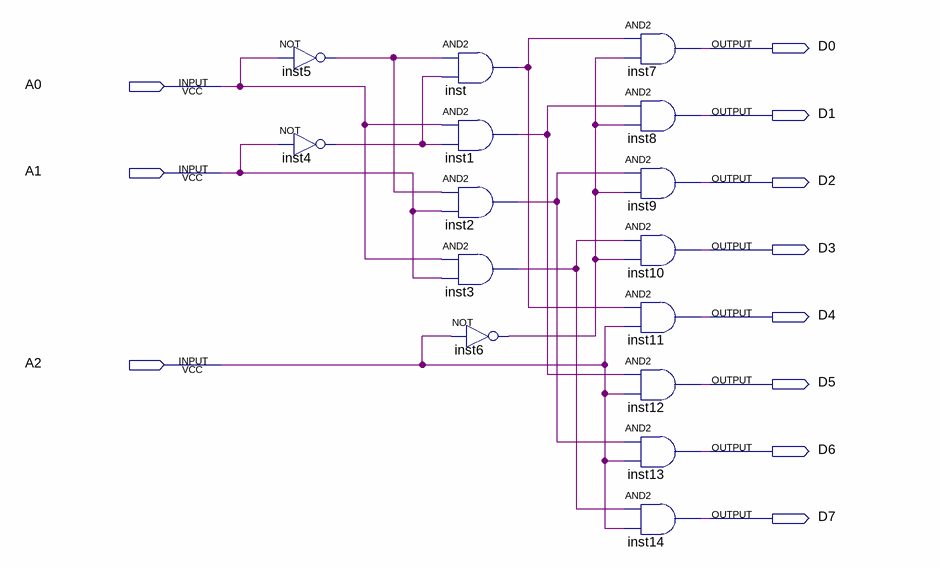
[diagram p0: schematic sheet]
// Quartus schematic decoder3_8.bdf as structural Verilog: 15 symbols, 11 pins
module decoder3_8 (
  input  A0,
  input  A1,
  input  A2,
  output D0,
  output D1,
  output D2,
  output D3,
  output D4,
  output D5,
  output D6,
  output D7
);

  wire inst1_out, inst2_out, inst3_out, inst4_out, inst5_out, inst6_out, inst_out;

  not inst5 (inst5_out, A0);
  not inst4 (inst4_out, A1);
  and inst (inst_out, inst5_out, inst4_out);
  and inst1 (inst1_out, A0, inst4_out);
  and inst2 (inst2_out, inst5_out, A1);
  and inst3 (inst3_out, A0, A1);
  not inst6 (inst6_out, A2);
  and inst7 (D0, inst_out, inst6_out);
  and inst8 (D1, inst1_out, inst6_out);
  and inst9 (D2, inst2_out, inst6_out);
  and inst10 (D3, inst3_out, inst6_out);
  and inst11 (D4, inst_out, A2);
  and inst12 (D5, inst1_out, A2);
  and inst13 (D6, inst2_out, A2);
  and inst14 (D7, inst3_out, A2);
endmodule
